# Altium project PCB_Project.PrjPcb
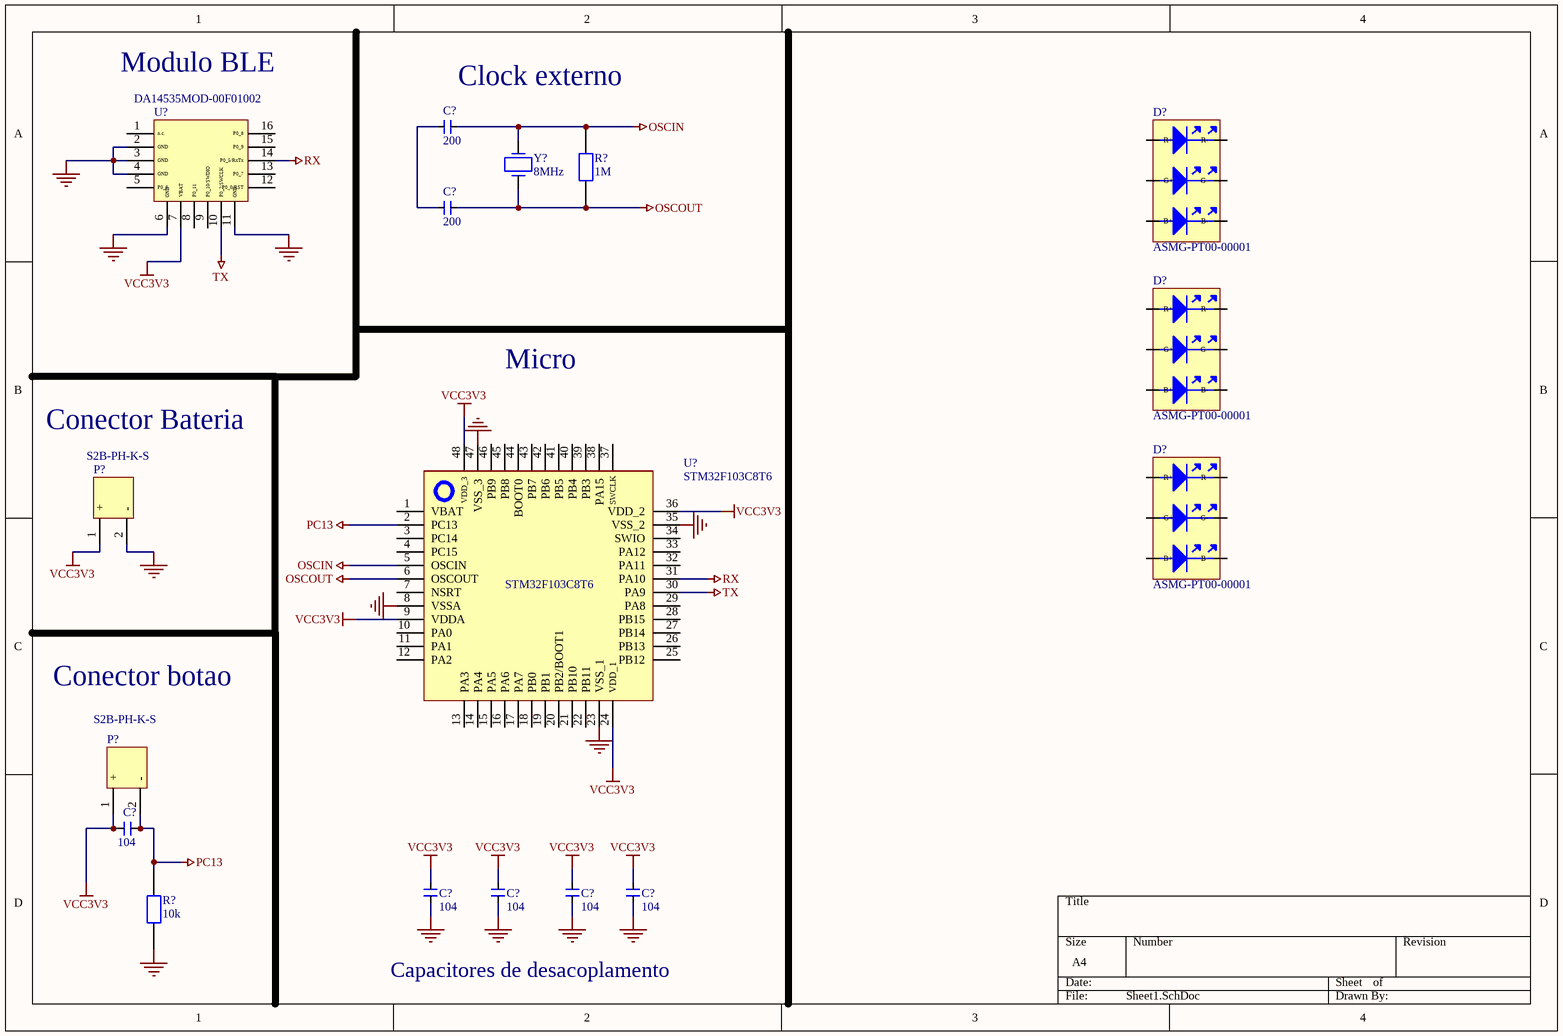
[diagram p0: Sheet1.SchDoc]
1 sheet, 17 parts. Net scope: global (net labels, ports and power ports of the same name join across sheets).
Board file: PCB1.PcbDoc

## Sheet Sheet1.SchDoc
size A4; SheetNumber: 1; SheetTotal: 1

### Parts
(Parts that share a designator on the sheet are numbered #1, #2 ... from top to bottom, then left to right.)
C?#1  200
C?#2  200
C?#3  104
C?#4  104
C?#5  104
C?#6  104
C?#7  104
D?#1  ASMG-PT00-00001
D?#2  ASMG-PT00-00001
D?#3  ASMG-PT00-00001
P?#1  S2B-PH-K-S
P?#2  S2B-PH-K-S
R?#1  1M
R?#2  10k
U?#1  DA14535MOD-00F01002
U?#2  STM32F103C8T6
Y?  8MHz

### Nets
GND: C?#4.2 C?#5.2 C?#6.2 C?#7.2 P?#1.2(-) R?#2.1 U?#1.2(GND) U?#1.3(GND) U?#1.4(GND) U?#1.6(GND) U?#1.11(GND) U?#2.8(VSSA) U?#2.23(VSS_1) U?#2.35(VSS_2) U?#2.47(VSS_3)
OSCIN: C?#1.2 R?#1.2 U?#2.5(OSCIN) Y?.1
OSCOUT: C?#2.2 R?#1.1 U?#2.6(OSCOUT) Y?.2
PC13: C?#3.2 P?#2.2(-) R?#2.2 U?#2.2(PC13)
RX: U?#1.14(P0_5/RxTx) U?#2.31(PA10)
TX: U?#1.10(P0_2/SWCLK) U?#2.30(PA9)
VCC3V3: C?#3.1 C?#4.1 C?#5.1 C?#6.1 C?#7.1 P?#1.1(+) P?#2.1(+) U?#1.7(VBAT) U?#2.9(VDDA) U?#2.24(VDD_1) U?#2.36(VDD_2) U?#2.48(VDD_3)
NetC?#1_1: C?#1.1 C?#2.1

Not connected (* = marked no-connect by the designer): D?#1 1(R+) 2(R-) 3(G+) 4(G-) 5(B+) 6(B-); D?#2 1(R+) 2(R-) 3(G+) 4(G-) 5(B+) 6(B-); D?#3 1(R+) 2(R-) 3(G+) 4(G-) 5(B+) 6(B-); U?#1 1(n.c.) 5(P0_6) 8(P0_11) 9(P0_10/SWDIO) 12(P0_0/RST) 13(P0_7) 15(P0_9) 16(P0_8); U?#2 1(VBAT) 3(PC14) 4(PC15) 7(NSRT) 10(PA0) 11(PA1) 12(PA2) 13(PA3) 14(PA4) 15(PA5) 16(PA6) 17(PA7) 18(PB0) 19(PB1) 20(PB2/BOOT1) 21(PB10) 22(PB11) 25(PB12) 26(PB13) 27(PB14) 28(PB15) 29(PA8) 32(PA11) 33(PA12) 34(SWIO) 37(SWCLK) 38(PA15) 39(PB3) 40(PB4) 41(PB5) 42(PB6) 43(PB7) 44(BOOT0) 45(PB8) 46(PB9)

### Notes on the sheet
- Modulo BLE
- (near C?#1) Clock externo
- Micro
- Conector Bateria
- Conector botao
- Capacitores de desacoplamento

### Library data of the parts
C?#1 C?#2 = CL10C200JB81PNC: Cap Ceramic 20pF 50V C0G 5% Pad SMD 0603 125C Automotive T/R; Manufacturer: Samsung Electro-Mechanics; Temperature Coefficient: 30ppm/°C; Supplier: DigiKey; Supplier Part Number: 1276-2219-1-ND; Manufacturer Part Number: CL10C200JB81PNC; RoHS: Compliant; Category: Ceramic Capacitors; Stock: 9751; Pricing: 1=0,12, 10=0,066, 50=0,043, 100=0,035, 500=0,0233, 1000=0,02004 (USD); Value: 20pF; Case/Package: 0603; Case Code (Imperial): 0603; Case Code (Metric): 1608; China RoHS: Compliant; Depth: 800µm; Dielectric: C0G; Dielectric Material: Ceramic; Height: 900µm; Length: 1.6002mm; Lifecycle Status: Production; Material: Ceramic; Max Operating Temperature: 125°C; Min Operating Temperature: -55°C; Mounting Technology: Surface Mount; Number of Terminals: 2; Packaging: Tape & Reel (TR); Ratings: AEC-Q200; REACH SVHC: Yes; Thickness: 889µm; Tolerance: 5%; Voltage Rating: 50V; Voltage Rating (DC): 50V; Width: 787.4µm; ComponentLink1URL: https://datasheet.octopart.com:443/CL10C200JB81PNC-Samsung-Electro-Mechanics-datasheet-176142735.pdf?src-supplier=IHS; ComponentLink1Description: https://datasheet.octopart.com:443/CL10C200JB81PNC-Samsung-Electro-Mechanics-datasheet-176142735.pdf?src-supplier=IHS; ComponentLink2URL: https://datasheet.octopart.com:443/CL10C200JB81PNC-Samsung-Electro-Mechanics-datasheet-141347356.pdf?src-supplier=Samsung+SCT; ComponentLink2Description: https://datasheet.octopart.com:443/CL10C200JB81PNC-Samsung-Electro-Mechanics-datasheet-141347356.pdf?src-supplier=Samsung+SCT; ComponentLink3URL: https://datasheet.octopart.com:443/CL10C200JB81PNC-Samsung-Electro-Mechanics-datasheet-11972684.pdf?src-supplier=Arrow+Electronics; ComponentLink3Description: https://datasheet.octopart.com:443/CL10C200JB81PNC-Samsung-Electro-Mechanics-datasheet-11972684.pdf?src-supplier=Arrow+Electronics
C?#3-C?#7 = CL03A104KP3NNNC: Ceramic Capacitor, Multilayer, Ceramic, 10V, 10% +Tol, 10% -Tol, X5R, +-15% TC, 100nF, Surface Mount, 0201 inch; Manufacturer: Samsung Electro-Mechanics; Supplier: DigiKey; Supplier Part Number: 1276-1115-1-ND; Manufacturer Part Number: CL03A104KP3NNNC; RoHS: Compliant; Category: Ceramic Capacitors; Stock: 3148810; Pricing: 1=0,08, 10=0,003 (USD); Value: 100nF; Case/Package: 0201; Case Code (Imperial): 0201; Case Code (Metric): 0603; China RoHS: Compliant; Contact Plating: Tin; Depth: 300µm; Dielectric: X5R; Dielectric Material: Ceramic; Height: 300µm; Lead Free: Lead Free; Length: 600µm; Lifecycle Status: Production; Material: Ceramic; Max Operating Temperature: 85°C; Min Operating Temperature: -55°C; Mounting Technology: Surface Mount; Number of Terminals: 2; Packaging: Tape & Reel; Radiation Hardening: No; REACH SVHC: Yes; Schedule B: 8532240020, 8532240020|8532240020, 8532240020|8532240020|8532240020, 8532240020|8532240020|8532240020|8532240020; Thickness: 330.2µm; Tolerance: 10%; Voltage Rating: 10V; Voltage Rating (DC): 10V; Width: 300µm; ComponentLink1URL: https://datasheet.octopart.com:443/CL03A104KP3NNNC-Samsung-Electro-Mechanics-datasheet-136031699.pdf?src-supplier=IHS; ComponentLink1Description: https://datasheet.octopart.com:443/CL03A104KP3NNNC-Samsung-Electro-Mechanics-datasheet-136031699.pdf?src-supplier=IHS; ComponentLink2URL: https://datasheet.octopart.com:443/CL03A104KP3NNNC-Samsung-Electro-Mechanics-datasheet-141346650.pdf?src-supplier=Samsung+SCT; ComponentLink2Description: https://datasheet.octopart.com:443/CL03A104KP3NNNC-Samsung-Electro-Mechanics-datasheet-141346650.pdf?src-supplier=Samsung+SCT; ComponentLink3URL: https://datasheet.octopart.com:443/CL03A104KP3NNNC-Samsung-Electro-Mechanics-datasheet-110226168.pdf?src-supplier=Future+Electronics; ComponentLink3Description: https://datasheet.octopart.com:443/CL03A104KP3NNNC-Samsung-Electro-Mechanics-datasheet-110226168.pdf?src-supplier=Future+Electronics; ComponentLink4URL: https://datasheet.octopart.com:443/CL03A104KP3NNNC-Samsung-Electro-Mechanics-datasheet-96443584.pdf?src-supplier=Future+Electronics; ComponentLink4Description: https://datasheet.octopart.com:443/CL03A104KP3NNNC-Samsung-Electro-Mechanics-datasheet-96443584.pdf?src-supplier=Future+Electronics; ComponentLink5URL: https://datasheet.octopart.com:443/CL03A104KP3NNNC-Samsung-Electro-Mechanics-datasheet-68297032.pdf?src-supplier=Future+Electronics; ComponentLink5Description: https://datasheet.octopart.com:443/CL03A104KP3NNNC-Samsung-Electro-Mechanics-datasheet-68297032.pdf?src-supplier=Future+Electronics; ComponentLink6URL: https://datasheet.octopart.com:443/CL03A104KP3NNNC-Samsung-datasheet-42485101.pdf?src-supplier=Future+Electronics; ComponentLink6Description: https://datasheet.octopart.com:443/CL03A104KP3NNNC-Samsung-datasheet-42485101.pdf?src-supplier=Future+Electronics; ComponentLink7URL: https://datasheet.octopart.com:443/CL03A104KP3NNNC-Samsung-datasheet-28508247.pdf?src-supplier=Future+Electronics; ComponentLink7Description: https://datasheet.octopart.com:443/CL03A104KP3NNNC-Samsung-datasheet-28508247.pdf?src-supplier=Future+Electronics; ComponentLink8URL: https://datasheet.octopart.com:443/CL03A104KP3NNNC-Samsung-datasheet-8325397.pdf?src-supplier=Future+Electronics; ComponentLink8Description: https://datasheet.octopart.com:443/CL03A104KP3NNNC-Samsung-datasheet-8325397.pdf?src-supplier=Future+Electronics; ComponentLink9URL: https://datasheet.octopart.com:443/CL03A104KP3NNNC-Samsung-Electro-Mechanics-datasheet-149136603.pdf?src-supplier=Future+Electronics; ComponentLink9Description: https://datasheet.octopart.com:443/CL03A104KP3NNNC-Samsung-Electro-Mechanics-datasheet-149136603.pdf?src-supplier=Future+Electronics; ComponentLink10URL: https://datasheet.octopart.com/CL03A104KP3NNNC-Samsung-Electro-Mechanics-datasheet-97040617.pdf; ComponentLink10Description: https://datasheet.octopart.com/CL03A104KP3NNNC-Samsung-Electro-Mechanics-datasheet-97040617.pdf; ComponentLink11URL: https://datasheet.octopart.com/CL03A104KP3NNNC-Samsung-Electro-Mechanics-datasheet-8324245.pdf; ComponentLink11Description: https://datasheet.octopart.com/CL03A104KP3NNNC-Samsung-Electro-Mechanics-datasheet-8324245.pdf; ComponentLink12URL: https://datasheet.octopart.com/General-Multilayer-Ceramic-Capacitors-Samsung-datasheet-family-111.pdf; ComponentLink12Description: https://datasheet.octopart.com/General-Multilayer-Ceramic-Capacitors-Samsung-datasheet-family-111.pdf; ComponentLink13URL: https://datasheet.octopart.com:443/CL03A104KP3NNNC-Samsung-datasheet-8326407.pdf?src-supplier=TME; ComponentLink13Description: https://datasheet.octopart.com:443/CL03A104KP3NNNC-Samsung-datasheet-8326407.pdf?src-supplier=TME; ComponentLink14URL: https://datasheet.octopart.com:443/CL03A104KP3NNNC-Samsung-Electro-Mechanics-datasheet-11541288.pdf?src-supplier=Arrow+Electronics; ComponentLink14Description: https://datasheet.octopart.com:443/CL03A104KP3NNNC-Samsung-Electro-Mechanics-datasheet-11541288.pdf?src-supplier=Arrow+Electronics; ComponentLink15URL: http://sigma.octopart.com:80/rohs_certificate/General-Multilayer-Ceramic-Capacitors-Samsung-family-110.pdf?src-supplier=Compliance+Statements; ComponentLink15Description: http://sigma.octopart.com:80/rohs_certificate/General-Multilayer-Ceramic-Capacitors-Samsung-family-110.pdf?src-supplier=Compliance+Statements; ComponentLink16URL: http://sigma.octopart.com:80/rohs_statement/General-Multilayer-Ceramic-Capacitors-Samsung-family-132.pdf?src-supplier=Compliance+Statements; ComponentLink16Description: http://sigma.octopart.com:80/rohs_statement/General-Multilayer-Ceramic-Capacitors-Samsung-family-132.pdf?src-supplier=Compliance+Statements; ComponentLink17URL: http://sigma.octopart.com:80/reach_statement/General-Multilayer-Ceramic-Capacitors-Samsung-family-133.pdf?src-supplier=Compliance+Statements; ComponentLink17Description: http://sigma.octopart.com:80/reach_statement/General-Multilayer-Ceramic-Capacitors-Samsung-family-133.pdf?src-supplier=Compliance+Statements
D?#1-D?#3 = ASMG-PT00-00001: 1W High Power LED Red/Green/Orange 630nm/535nm/460nm 28lm/45lm/9.5lm 6-Pin SMD T/R; Manufacturer: Avago; Forward Current: 200mA; Forward Voltage: 2.8V; Number of Circuits: 1; Shape: Round; Viewing Angle: 150°; Supplier: DigiKey; Supplier Part Number: 516-4178-1-ND; Manufacturer Part Number: ASMG-PT00-00001; RoHS: Compliant; Category: LEDs; Stock: 2617; Pricing: 1=7,73, 10=5,867, 100=4,7744 (USD); Height: 1.85mm; Lifecycle Status: Production; Max Operating Temperature: 105°C; Min Operating Temperature: -40°C; Mounting Technology: Surface Mount; Number of Terminals: 6; REACH SVHC: Yes; Terminal Pitch: 1.32mm; ComponentLink1URL: https://datasheet.octopart.com:443/ASMG-PT00-00001-Broadcom-datasheet-179992978.pdf?src-supplier=IHS; ComponentLink1Description: https://datasheet.octopart.com:443/ASMG-PT00-00001-Broadcom-datasheet-179992978.pdf?src-supplier=IHS; ComponentLink2URL: https://datasheet.octopart.com:443/ASMG-PT00-00001-Avago-datasheet-104530126.pdf?src-supplier=Avago; ComponentLink2Description: https://datasheet.octopart.com:443/ASMG-PT00-00001-Avago-datasheet-104530126.pdf?src-supplier=Avago; ComponentLink3URL: https://datasheet.octopart.com:443/ASMG-PT00-00001-Broadcom-datasheet-141402584.pdf?src-supplier=element14+APAC; ComponentLink3Description: https://datasheet.octopart.com:443/ASMG-PT00-00001-Broadcom-datasheet-141402584.pdf?src-supplier=element14+APAC; ComponentLink4URL: https://datasheet.octopart.com:443/ASMG-PT00-00001-Broadcom-datasheet-104526721.pdf?src-supplier=Newark; ComponentLink4Description: https://datasheet.octopart.com:443/ASMG-PT00-00001-Broadcom-datasheet-104526721.pdf?src-supplier=Newark
P?#1 P?#2 = S2B-PH-K-S: Header S2B-PH-K-S, 2.00mm, 2-contacts, side entry, THT /1000/box/; Manufacturer: JST; Connector Type: Male Pin; Gender: Male; Number of Contacts: 2; Pitch: 2.0066mm; Supplier: DigiKey; Supplier Part Number: 455-1719-ND; Manufacturer Part Number: S2B-PH-K-S; RoHS: Compliant; Category: Headers and Wire Housings; Stock: 969719; Pricing: 1=0,1, 10=0,082, 100=0,0698, 500=0,06228, 1000=0,05929, 5000=0,05292, 10000=0,05039 (USD); Contact Gender: Male; Contact Material: Brass; Contact Mating Length: 3.302mm; Contact Plating: Tin; Fastening Type: Detent; Housing Color: Natural; Housing Material: Nylon; Lead Free: Contains Lead; Lead Pitch: 2mm; Lifecycle Status: Obsolete; Mounting Technology: Through Hole; Pins: 2; Number of Positions: 2; Number of Rows: 1; Orientation: Horizontal; Packaging: Bulk; Terminal Pitch: 2mm; Termination: Press-Fit; ComponentLink1URL: https://datasheet.octopart.com:443/S2B-PH-K-S-JST-datasheet-15068535.pdf?src-supplier=IHS; ComponentLink1Description: https://datasheet.octopart.com:443/S2B-PH-K-S-JST-datasheet-15068535.pdf?src-supplier=IHS; ComponentLink2URL: https://datasheet.octopart.com:443/S2B-PH-K-S-JST-datasheet-12510261.pdf?src-supplier=TME; ComponentLink2Description: https://datasheet.octopart.com:443/S2B-PH-K-S-JST-datasheet-12510261.pdf?src-supplier=TME; ComponentLink3URL: https://datasheet.octopart.com:443/S2B-PH-K-S-JST-datasheet-56537.pdf?src-supplier=DigiKey; ComponentLink3Description: https://datasheet.octopart.com:443/S2B-PH-K-S-JST-datasheet-56537.pdf?src-supplier=DigiKey; ComponentLink4URL: https://datasheet.octopart.com:443/S2B-PH-K-S-JST-datasheet-159515011.pdf?src-supplier=Amar+Radio+Corporation; ComponentLink4Description: https://datasheet.octopart.com:443/S2B-PH-K-S-JST-datasheet-159515011.pdf?src-supplier=Amar+Radio+Corporation
R?#1 = ERJ-PA3F1004V: Res Thick Film 0603 1M Ohm 1% 0.25W(1/4W) ±100ppm/C Pad SMD Automotive T/R; Manufacturer: Panasonic; Max Power Dissipation: 250mW; Value: 1MΩ; Temperature Coefficient: 100ppm/°C; Voltage Rating: 150V; Supplier: DigiKey; Supplier Part Number: P1.0MBYCT-ND; Manufacturer Part Number: ERJ-PA3F1004V; RoHS: Compliant; Category: Chip SMD Resistors; Stock: 243307; Pricing: 1=0,14, 10=0,068, 25=0,0532, 50=0,0446, 100=0,0377, 250=0,03096, 500=0,0271, 1000=0,02402 (USD); Case/Package: 0603; Case Code (Imperial): 0603; Case Code (Metric): 1608; Composition: Thick Film; Depth: 800µm; Features: Automotive AEC-Q200; Height: 450µm; Length: 1.6002mm; Lifecycle Status: Production; Max Operating Temperature: 155°C; Min Operating Temperature: -55°C; Mounting Technology: Surface Mount; Number of Terminals: 2; Number of Terminations: 2; Packaging: Cut Tape; Power Dissipation: 250mW; Power Rating: 250mW; REACH SVHC: Yes; Schedule B: 8533210045, 8533210045|8533210045|8533210045|8533210045|8533210045|8533210045|8533210045|8533210045|8533210045|8533210045|8533210045|8533210045|8533210045|8533210045|8533210045|8533210045|8533210045|8533210045|8533210045|8533210045|8533210045|8533210045|8533210045|85; Termination: Solder; Tolerance: 1%; Voltage Rating (DC): 150V; Width: 800µm; Working Voltage: 150V; ComponentLink1URL: https://datasheet.octopart.com:443/ERJ-PA3F1004V-Panasonic-datasheet-68299097.pdf?src-supplier=Future+Electronics; ComponentLink1Description: https://datasheet.octopart.com:443/ERJ-PA3F1004V-Panasonic-datasheet-68299097.pdf?src-supplier=Future+Electronics; ComponentLink2URL: https://datasheet.octopart.com:443/ERJ-PA3F1004V-Panasonic-datasheet-136608609.pdf?src-supplier=Farnell; ComponentLink2Description: https://datasheet.octopart.com:443/ERJ-PA3F1004V-Panasonic-datasheet-136608609.pdf?src-supplier=Farnell; ComponentLink3URL: https://datasheet.octopart.com:443/ERJPA3F1004V-Panasonic-datasheet-21212021.pdf?src-supplier=Farnell; ComponentLink3Description: https://datasheet.octopart.com:443/ERJPA3F1004V-Panasonic-datasheet-21212021.pdf?src-supplier=Farnell; ComponentLink4URL: https://datasheet.octopart.com:443/ERJPA3F1004V-Panasonic-datasheet-16484091.pdf?src-supplier=Farnell; ComponentLink4Description: https://datasheet.octopart.com:443/ERJPA3F1004V-Panasonic-datasheet-16484091.pdf?src-supplier=Farnell; ComponentLink5URL: https://datasheet.octopart.com:443/ERJPA3F1004V-Panasonic-datasheet-5389633.pdf?src-supplier=RS+(Formerly+Allied+Electronics); ComponentLink5Description: https://datasheet.octopart.com:443/ERJPA3F1004V-Panasonic-datasheet-5389633.pdf?src-supplier=RS+(Formerly+Allied+Electronics); ComponentLink6URL: https://datasheet.octopart.com:443/ERJ-PA3F1004V-Panasonic-datasheet-142522929.pdf?src-supplier=Master+Electronics; ComponentLink6Description: https://datasheet.octopart.com:443/ERJ-PA3F1004V-Panasonic-datasheet-142522929.pdf?src-supplier=Master+Electronics; ComponentLink7URL: https://datasheet.octopart.com:443/ERJPA3F1004V-Panasonic-datasheet-10838877.pdf?src-supplier=element14+APAC; ComponentLink7Description: https://datasheet.octopart.com:443/ERJPA3F1004V-Panasonic-datasheet-10838877.pdf?src-supplier=element14+APAC; ComponentLink8URL: https://datasheet.octopart.com:443/ERJPA3F1004V-Panasonic-datasheet-10403718.pdf?src-supplier=element14+APAC; ComponentLink8Description: https://datasheet.octopart.com:443/ERJPA3F1004V-Panasonic-datasheet-10403718.pdf?src-supplier=element14+APAC; ComponentLink9URL: https://datasheet.octopart.com:443/ERJPA3F1004V-Panasonic-datasheet-10096723.pdf?src-supplier=element14+APAC; ComponentLink9Description: https://datasheet.octopart.com:443/ERJPA3F1004V-Panasonic-datasheet-10096723.pdf?src-supplier=element14+APAC; ComponentLink10URL: https://datasheet.octopart.com:443/ERJPA3F1004V-Panasonic-datasheet-8399050.pdf?src-supplier=element14+APAC; ComponentLink10Description: https://datasheet.octopart.com:443/ERJPA3F1004V-Panasonic-datasheet-8399050.pdf?src-supplier=element14+APAC; ComponentLink11URL: https://datasheet.octopart.com:443/ERJPA3F1004V-Panasonic-datasheet-13272697.pdf?src-supplier=element14+APAC; ComponentLink11Description: https://datasheet.octopart.com:443/ERJPA3F1004V-Panasonic-datasheet-13272697.pdf?src-supplier=element14+APAC; ComponentLink12URL: https://datasheet.octopart.com:443/ERJPA3F1004V-Panasonic-datasheet-60482970.pdf?src-supplier=element14+APAC; ComponentLink12Description: https://datasheet.octopart.com:443/ERJPA3F1004V-Panasonic-datasheet-60482970.pdf?src-supplier=element14+APAC; ComponentLink13URL: https://datasheet.octopart.com:443/ERJPA3F1004V-Panasonic-datasheet-170667599.pdf?src-supplier=TME; ComponentLink13Description: https://datasheet.octopart.com:443/ERJPA3F1004V-Panasonic-datasheet-170667599.pdf?src-supplier=TME; ComponentLink14URL: https://datasheet.octopart.com:443/ERJPA3F1004V-Panasonic-datasheet-164871483.pdf?src-supplier=Burklin+Elektronik; ComponentLink14Description: https://datasheet.octopart.com:443/ERJPA3F1004V-Panasonic-datasheet-164871483.pdf?src-supplier=Burklin+Elektronik; ComponentLink15URL: https://datasheet.octopart.com:443/ERJ-PA3F1004V-Panasonic-datasheet-62334979.pdf?src-supplier=Newark; ComponentLink15Description: https://datasheet.octopart.com:443/ERJ-PA3F1004V-Panasonic-datasheet-62334979.pdf?src-supplier=Newark
R?#2 = ERA-3AEB103V: Res Thin Film 0603 10K Ohm 0.1% 1/10W ±25ppm/°C Molded SMD SMD Punched Carrier T/R; Manufacturer: Panasonic; Max Power Dissipation: 100mW; Value: 10kΩ; Voltage Rating: 75V; Supplier: DigiKey; Supplier Part Number: P10KDBCT-ND; Manufacturer Part Number: ERA-3AEB103V; RoHS: Compliant; Category: Chip SMD Resistors; Stock: 1068541; Pricing: 1=0,1, 10=0,061, 25=0,0568, 50=0,0536, 100=0,0506, 250=0,04692, 500=0,04438, 1000=0,04206 (USD); Case/Package: 0603; Case Code (Imperial): 0603; Composition: Thin Film; Contact Plating: Tin; Depth: 800µm; Height: 450µm; Lead Free: Lead Free; Length: 1.6mm; Lifecycle Status: Production; Max Operating Temperature: 155°C; Military Standard: Not; Min Operating Temperature: -55°C; Mounting Technology: Surface Mount; Pins: 2; Number of Terminals: 2; Number of Terminations: 2; Packaging: Cut Tape; Power Dissipation: 100mW; Power Rating: 100mW; Radiation Hardening: No; REACH SVHC: Yes; Schedule B: 8533210045, 8533210045|8533210045|8533210045|8533210045|8533210045|8533210045|8533210045|8533210045|8533210045|8533210045|8533210045|8533210045|8533210045|8533210045|8533210045|8533210045|8533210045|8533210045|8533210045|8533210045|8533210045|8533210045|8533210045|85; Temperature Coefficient: 25ppm/°C; Termination: SMD/SMT; Tolerance: 0.1%; Voltage Rating (DC): 75V; Width: 800µm; Working Voltage: 75V; ComponentLink1URL: https://sigma.octopart.com:443/138766958/technical_drawing/Panasonic-ERA-3AEB103V.pdf?src-supplier=Upverter; ComponentLink1Description: https://sigma.octopart.com:443/138766958/technical_drawing/Panasonic-ERA-3AEB103V.pdf?src-supplier=Upverter; ComponentLink2URL: https://datasheet.octopart.com:443/ERA-3AEB103V-Panasonic-datasheet-62287448.pdf?src-supplier=Newark; ComponentLink2Description: https://datasheet.octopart.com:443/ERA-3AEB103V-Panasonic-datasheet-62287448.pdf?src-supplier=Newark; ComponentLink3URL: https://datasheet.octopart.com:443/ERA-3AEB103V-Panasonic-datasheet-118567.pdf?src-supplier=Newark; ComponentLink3Description: https://datasheet.octopart.com:443/ERA-3AEB103V-Panasonic-datasheet-118567.pdf?src-supplier=Newark; ComponentLink4URL: https://datasheet.octopart.com:443/ERA-3AEB103V-Panasonic-datasheet-61114971.pdf?src-supplier=Newark; ComponentLink4Description: https://datasheet.octopart.com:443/ERA-3AEB103V-Panasonic-datasheet-61114971.pdf?src-supplier=Newark; ComponentLink5URL: https://datasheet.octopart.com:443/ERA3AEB103V-Panasonic-datasheet-22087624.pdf?src-supplier=Newark; ComponentLink5Description: https://datasheet.octopart.com:443/ERA3AEB103V-Panasonic-datasheet-22087624.pdf?src-supplier=Newark; ComponentLink6URL: https://datasheet.octopart.com:443/ERA-3AEB103V-Panasonic-datasheet-136531316.pdf?src-supplier=Farnell; ComponentLink6Description: https://datasheet.octopart.com:443/ERA-3AEB103V-Panasonic-datasheet-136531316.pdf?src-supplier=Farnell; ComponentLink7URL: https://datasheet.octopart.com:443/ERA-3AEB103V-Panasonic-datasheet-13266200.pdf?src-supplier=RS+(Formerly+Allied+Electronics); ComponentLink7Description: https://datasheet.octopart.com:443/ERA-3AEB103V-Panasonic-datasheet-13266200.pdf?src-supplier=RS+(Formerly+Allied+Electronics); ComponentLink8URL: https://datasheet.octopart.com:443/ERA-3AEB103V-Panasonic-datasheet-46744048.pdf?src-supplier=RS+(Formerly+Allied+Electronics); ComponentLink8Description: https://datasheet.octopart.com:443/ERA-3AEB103V-Panasonic-datasheet-46744048.pdf?src-supplier=RS+(Formerly+Allied+Electronics); ComponentLink9URL: https://datasheet.octopart.com:443/ERA-3AEB103V-Panasonic-datasheet-10840895.pdf?src-supplier=Future+Electronics; ComponentLink9Description: https://datasheet.octopart.com:443/ERA-3AEB103V-Panasonic-datasheet-10840895.pdf?src-supplier=Future+Electronics; ComponentLink10URL: https://datasheet.octopart.com:443/ERA-3AEB103V-Panasonic-datasheet-8367715.pdf?src-supplier=Future+Electronics; ComponentLink10Description: https://datasheet.octopart.com:443/ERA-3AEB103V-Panasonic-datasheet-8367715.pdf?src-supplier=Future+Electronics; ComponentLink11URL: https://datasheet.octopart.com:443/ERA-3AEB103V-Panasonic-datasheet-12510007.pdf?src-supplier=Future+Electronics; ComponentLink11Description: https://datasheet.octopart.com:443/ERA-3AEB103V-Panasonic-datasheet-12510007.pdf?src-supplier=Future+Electronics; ComponentLink12URL: https://datasheet.octopart.com:443/ERA-3AEB103V-Panasonic-datasheet-11763931.pdf?src-supplier=Future+Electronics; ComponentLink12Description: https://datasheet.octopart.com:443/ERA-3AEB103V-Panasonic-datasheet-11763931.pdf?src-supplier=Future+Electronics; ComponentLink13URL: https://datasheet.octopart.com:443/ERA-3AEB103V-Panasonic-datasheet-5392808.pdf?src-supplier=Future+Electronics; ComponentLink13Description: https://datasheet.octopart.com:443/ERA-3AEB103V-Panasonic-datasheet-5392808.pdf?src-supplier=Future+Electronics; ComponentLink14URL: https://datasheet.octopart.com:443/ERA-3AEB103V-Panasonic-datasheet-154766165.pdf?src-supplier=Master+Electronics; ComponentLink14Description: https://datasheet.octopart.com:443/ERA-3AEB103V-Panasonic-datasheet-154766165.pdf?src-supplier=Master+Electronics; ComponentLink15URL: https://datasheet.octopart.com:443/ERA3AEB103V-Panasonic-datasheet-188913046.pdf?src-supplier=TME; ComponentLink15Description: https://datasheet.octopart.com:443/ERA3AEB103V-Panasonic-datasheet-188913046.pdf?src-supplier=TME; ComponentLink16URL: https://sigma.octopart.com:443/150570796/technical_drawing/Panasonic-ERA3AEB103V.pdf?src-supplier=Panasonic+SCT; ComponentLink16Description: https://sigma.octopart.com:443/150570796/technical_drawing/Panasonic-ERA3AEB103V.pdf?src-supplier=Panasonic+SCT; ComponentLink17URL: https://datasheet.octopart.com:443/ERA3AEB103V-Panasonic-datasheet-138783076.pdf?src-supplier=Burklin+Elektronik; ComponentLink17Description: https://datasheet.octopart.com:443/ERA3AEB103V-Panasonic-datasheet-138783076.pdf?src-supplier=Burklin+Elektronik; ComponentLink18URL: https://datasheet.octopart.com/ERA-3AEB103V-Panasonic-datasheet-78375410.pdf; ComponentLink18Description: https://datasheet.octopart.com/ERA-3AEB103V-Panasonic-datasheet-78375410.pdf; ComponentLink19URL: https://datasheet.octopart.com:443/ERA-3AEB103V-Panasonic-datasheet-10050158.pdf?src-supplier=Arrow+Electronics; ComponentLink19Description: https://datasheet.octopart.com:443/ERA-3AEB103V-Panasonic-datasheet-10050158.pdf?src-supplier=Arrow+Electronics; ComponentLink20URL: https://datasheet.octopart.com:443/ERA-3AEB103V-Panasonic-datasheet-33006989.pdf?src-supplier=Electro+Sonic; ComponentLink20Description: https://datasheet.octopart.com:443/ERA-3AEB103V-Panasonic-datasheet-33006989.pdf?src-supplier=Electro+Sonic
U?#1 = DA14535MOD-00F01002: Bluetooth Mod, Ble 5.3, 1.8 - 3.6V Rohs Compliant: Yes |Renesas DA14535MOD-00F01002; Manufacturer Lifecycle Status: ACTIVE; Pitch: 1.5mm; Supplier: DigiKey; Supplier Part Number: 1695-DA14535MOD-00F01002CT-ND; Manufacturer: Renesas; Manufacturer Part Number: DA14535MOD-00F01002; Category: RF Transceiver Modules and Modems; Stock: 692; Pricing: 1=6,97, 10=6,039, 25=5,7156, 100=5,2718, 250=5,00596, 500=4,8183 (USD); Case/Package: Module; Export Control Classification Number (ECCN) Code: EAR99; Part Family: DA14535MOD; Harmonized Tariff Schedule (HTS) Code: 8542.39.90; Lifecycle Status: Production; MSL: 3; Pins: 15; Packaging: Tape & Reel; ComponentLink1URL: https://datasheet.octopart.com:443/DA14535MOD-00F01002-Renesas-datasheet-182587836.pdf?src-supplier=Renesas; ComponentLink1Description: https://datasheet.octopart.com:443/DA14535MOD-00F01002-Renesas-datasheet-182587836.pdf?src-supplier=Renesas; ComponentLink2URL: http://sigma.octopart.com:80/conflict_mineral_statement/Renesas-company-44.pdf?src-supplier=Compliance+Statements; ComponentLink2Description: http://sigma.octopart.com:80/conflict_mineral_statement/Renesas-company-44.pdf?src-supplier=Compliance+Statements; ComponentLink3URL: http://sigma.octopart.com:80/reach_statement/Renesas-company-45.pdf?src-supplier=Compliance+Statements; ComponentLink3Description: http://sigma.octopart.com:80/reach_statement/Renesas-company-45.pdf?src-supplier=Compliance+Statements
U?#2 = STM32F103C8T6: MCU 32-bit STM32F1 ARM Cortex M3 RISC 64KB Flash 2.5V/3.3V 48-Pin LQFP Tray; Manufacturer: STMicroelectronics; Manufacturer Package Identifier: ai14911d; ADC Channels (Resolution): 10-Ch 12-Bit; Address Bus Width: 32b; Density: 512kb; EEPROM Memory Size: 0B; Frequency: 72MHz; Interface: CAN, USB; Clock Frequency: 16MHz; Max Power Dissipation: 363mW; Max Supply Current: 50mA; Max Supply Voltage: 3.6V; Min Supply Voltage: 2V; Nominal Supply Current: 1.7µA; Number of A/D Converters: 2; Number of ADC Channels: 10; Number of Bits: 32; Number of I/Os: 37; Number of Interrupts: 16; Number of Programmable I/O: 48; Number of PWM Channels: 1; Number of Timers/Counters: 4; Number of USART Channels: 3; Operating Supply Voltage: 3.3V; Oscillator Type: Internal; Peripherals: POR; RAM Size: 20kB; Watchdog Timer: Yes; Supplier: DigiKey; Supplier Part Number: 497-6063-ND; Manufacturer Part Number: STM32F103C8T6; RoHS: Compliant; Category: Microcontrollers; Stock: 4493; Pricing: 1=6,08, 10=4,662, 25=4,3084, 100=3,9192, 250=3,73372, 500=3,6219, 1000=3,5299, 2500=3,43276 (USD); Case/Package: LQFP; China RoHS: Compliant; Core Architecture: ARM; Data Bus Width: 32b; Flash Memory Size: 64kB; Height: 1.45mm; Height - Seated (Max): 1.6mm; Lead Free: Lead Free; Length: 7mm; Lifecycle Status: Production; Max Operating Temperature: 85°C; Memory Size: 64kB; Memory Format: FLASH; Min Operating Temperature: -40°C; Mounting Technology: Surface Mount; Number of Channels: 10; Number of I2C Channels: 2; Pins: 48; Number of SPI Channels: 2; Number of Terminals: 48; Radiation Hardening: No; REACH SVHC: Yes; Schedule B: 8542310000; Terminal Pitch: 500µm; Termination: SMD/SMT; Width: 7mm; ComponentLink1URL: https://datasheet.octopart.com:443/STM32F103C8T6-STMicroelectronics-datasheet-48026265.pdf?src-supplier=ICpick; ComponentLink1Description: https://datasheet.octopart.com:443/STM32F103C8T6-STMicroelectronics-datasheet-48026265.pdf?src-supplier=ICpick; ComponentLink2URL: https://datasheet.octopart.com:443/STM32F103C8T6-STMicroelectronics-datasheet-10330614.pdf?src-supplier=Newark; ComponentLink2Description: https://datasheet.octopart.com:443/STM32F103C8T6-STMicroelectronics-datasheet-10330614.pdf?src-supplier=Newark; ComponentLink3URL: https://datasheet.octopart.com:443/STM32F103C8T6-STMicroelectronics-datasheet-16839800.pdf?src-supplier=Newark; ComponentLink3Description: https://datasheet.octopart.com:443/STM32F103C8T6-STMicroelectronics-datasheet-16839800.pdf?src-supplier=Newark; ComponentLink4URL: https://datasheet.octopart.com:443/STM32F103C8T6-STMicroelectronics-datasheet-14363502.pdf?src-supplier=Farnell; ComponentLink4Description: https://datasheet.octopart.com:443/STM32F103C8T6-STMicroelectronics-datasheet-14363502.pdf?src-supplier=Farnell; ComponentLink5URL: https://datasheet.octopart.com:443/STM32F103C8T6-STMicroelectronics-datasheet-500013.pdf?src-supplier=Farnell; ComponentLink5Description: https://datasheet.octopart.com:443/STM32F103C8T6-STMicroelectronics-datasheet-500013.pdf?src-supplier=Farnell; ComponentLink6URL: https://datasheet.octopart.com:443/STM32F103C8T6-STMicroelectronics-datasheet-8365036.pdf?src-supplier=Farnell; ComponentLink6Description: https://datasheet.octopart.com:443/STM32F103C8T6-STMicroelectronics-datasheet-8365036.pdf?src-supplier=Farnell; ComponentLink7URL: https://datasheet.octopart.com:443/STM32F103C8T6-STMicroelectronics-datasheet-6396519.pdf?src-supplier=Verical; ComponentLink7Description: https://datasheet.octopart.com:443/STM32F103C8T6-STMicroelectronics-datasheet-6396519.pdf?src-supplier=Verical; ComponentLink8URL: https://datasheet.octopart.com:443/STM32F103C8T6-STMicroelectronics-datasheet-21407612.pdf?src-supplier=element14+APAC; ComponentLink8Description: https://datasheet.octopart.com:443/STM32F103C8T6-STMicroelectronics-datasheet-21407612.pdf?src-supplier=element14+APAC; ComponentLink9URL: https://datasheet.octopart.com:443/STM32F103C8T6-STMicroelectronics-datasheet-8700640.pdf?src-supplier=element14; ComponentLink9Description: https://datasheet.octopart.com:443/STM32F103C8T6-STMicroelectronics-datasheet-8700640.pdf?src-supplier=element14; ComponentLink10URL: https://datasheet.octopart.com:443/STM32F103C8T6-STMicroelectronics-datasheet-177520228.pdf?src-supplier=Burklin+Elektronik; ComponentLink10Description: https://datasheet.octopart.com:443/STM32F103C8T6-STMicroelectronics-datasheet-177520228.pdf?src-supplier=Burklin+Elektronik; ComponentLink11URL: https://datasheet.octopart.com:443/STM32F103C8T6-STMicroelectronics-datasheet-165583531.pdf?src-supplier=SOS+electronic; ComponentLink11Description: https://datasheet.octopart.com:443/STM32F103C8T6-STMicroelectronics-datasheet-165583531.pdf?src-supplier=SOS+electronic; ComponentLink12URL: https://datasheet.octopart.com:443/STM32F103C8T6-STMicroelectronics-datasheet-14106722.pdf?src-supplier=iiiC; ComponentLink12Description: https://datasheet.octopart.com:443/STM32F103C8T6-STMicroelectronics-datasheet-14106722.pdf?src-supplier=iiiC; ComponentLink13URL: https://datasheet.octopart.com:443/STM32F103C8T6-STMicroelectronics-datasheet-17594274.pdf?src-supplier=TME; ComponentLink13Description: https://datasheet.octopart.com:443/STM32F103C8T6-STMicroelectronics-datasheet-17594274.pdf?src-supplier=TME; ComponentLink14URL: https://datasheet.octopart.com:443/STM32F103C8T6-STMicroelectronics-datasheet-148251.pdf?src-supplier=Nu+Horizons; ComponentLink14Description: https://datasheet.octopart.com:443/STM32F103C8T6-STMicroelectronics-datasheet-148251.pdf?src-supplier=Nu+Horizons
Y? = ABM3-8.000MHZ-D2Y-T: Crystal 8MHz ±20ppm (Tol) ±30ppm (Stability) 18pF FUND 140Ohm 2-Pin Mini-CSMD T/R; Manufacturer: Abracon; ESR (Equivalent Series Resistance): 140Ω; Frequency Tolerance: 0.002%; Supplier: DigiKey; Supplier Part Number: 535-10630-1-ND; Manufacturer Part Number: ABM3-8.000MHZ-D2Y-T; RoHS: Compliant; Category: Crystals; Stock: 32401; Pricing: 1=0,67, 10=0,585, 25=0,5536, 50=0,5306, 100=0,5087, 250=0,48104, 500=0,46114 (USD); Case/Package: CSMD; China RoHS: Non-Compliant; Composition: Ceramic; Depth: 3.2mm; Frequency: 8MHz; Frequency Stability: 30ppm; Height: 1.3mm; Lead Free: Lead Free; Length: 5mm; Lifecycle Status: Production; Load Capacitance: 18pF; Max Operating Temperature: 85°C; Min Operating Temperature: -40°C; Mounting Technology: Surface Mount; Pins: 2; Packaging: Cut Tape; Radiation Hardening: No; REACH SVHC: Yes; Schedule B: 8541600025, 8541600025|8541600025|8541600025|8541600025|8541600025|8541600025|8541600025|8541600025|8541600025|8541600025|8541600025|8541600025|8541600025|8541600025|8541600025|8541600025|8541600025|8541600025|8541600025|8541600025|8541600025|8541600025|8541600025|85; ESR: 140Ω; Termination: SMD/SMT; Tolerance: 0.002%; Width: 3.2mm; ComponentLink1URL: https://datasheet.octopart.com:443/ABM3-8.000MHZ-D2Y-T-Abracon-datasheet-182205007.pdf?src-supplier=TME; ComponentLink1Description: https://datasheet.octopart.com:443/ABM3-8.000MHZ-D2Y-T-Abracon-datasheet-182205007.pdf?src-supplier=TME; ComponentLink2URL: https://datasheet.octopart.com:443/ABM3-8.000MHZ-D2Y-T-Abracon-datasheet-32780515.pdf?src-supplier=element14+APAC; ComponentLink2Description: https://datasheet.octopart.com:443/ABM3-8.000MHZ-D2Y-T-Abracon-datasheet-32780515.pdf?src-supplier=element14+APAC; ComponentLink3URL: https://datasheet.octopart.com:443/ABM3-8.000MHZ-D2Y-T-Abracon-datasheet-13417521.pdf?src-supplier=element14+APAC; ComponentLink3Description: https://datasheet.octopart.com:443/ABM3-8.000MHZ-D2Y-T-Abracon-datasheet-13417521.pdf?src-supplier=element14+APAC; ComponentLink4URL: https://datasheet.octopart.com:443/ABM3-8.000MHZ-D2Y-T-Abracon-datasheet-8862594.pdf?src-supplier=element14+APAC; ComponentLink4Description: https://datasheet.octopart.com:443/ABM3-8.000MHZ-D2Y-T-Abracon-datasheet-8862594.pdf?src-supplier=element14+APAC; ComponentLink5URL: https://datasheet.octopart.com:443/ABM3-8.000MHZ-D2Y-T-Abracon-datasheet-8853172.pdf?src-supplier=element14+APAC; ComponentLink5Description: https://datasheet.octopart.com:443/ABM3-8.000MHZ-D2Y-T-Abracon-datasheet-8853172.pdf?src-supplier=element14+APAC; ComponentLink6URL: https://datasheet.octopart.com:443/ABM3-8.000MHZ-D2Y-T-Abracon-datasheet-8835795.pdf?src-supplier=element14+APAC; ComponentLink6Description: https://datasheet.octopart.com:443/ABM3-8.000MHZ-D2Y-T-Abracon-datasheet-8835795.pdf?src-supplier=element14+APAC; ComponentLink7URL: https://datasheet.octopart.com:443/ABM3-8.000MHZ-D2Y-T-Abracon-datasheet-8815637.pdf?src-supplier=element14+APAC; ComponentLink7Description: https://datasheet.octopart.com:443/ABM3-8.000MHZ-D2Y-T-Abracon-datasheet-8815637.pdf?src-supplier=element14+APAC; ComponentLink8URL: https://datasheet.octopart.com:443/ABM3-8.000MHZ-D2Y-T-Abracon-datasheet-8808528.pdf?src-supplier=element14+APAC; ComponentLink8Description: https://datasheet.octopart.com:443/ABM3-8.000MHZ-D2Y-T-Abracon-datasheet-8808528.pdf?src-supplier=element14+APAC; ComponentLink9URL: https://datasheet.octopart.com:443/ABM3-8.000MHZ-D2Y-T-Abracon-datasheet-8488864.pdf?src-supplier=element14+APAC; ComponentLink9Description: https://datasheet.octopart.com:443/ABM3-8.000MHZ-D2Y-T-Abracon-datasheet-8488864.pdf?src-supplier=element14+APAC; ComponentLink10URL: https://datasheet.octopart.com:443/ABM3-8.000MHZ-D2Y-T-Abracon-datasheet-8324950.pdf?src-supplier=element14+APAC; ComponentLink10Description: https://datasheet.octopart.com:443/ABM3-8.000MHZ-D2Y-T-Abracon-datasheet-8324950.pdf?src-supplier=element14+APAC; ComponentLink11URL: https://datasheet.octopart.com:443/ABM3-8.000MHZ-D2Y-T-Abracon-datasheet-577709.pdf?src-supplier=element14+APAC; ComponentLink11Description: https://datasheet.octopart.com:443/ABM3-8.000MHZ-D2Y-T-Abracon-datasheet-577709.pdf?src-supplier=element14+APAC; ComponentLink12URL: https://datasheet.octopart.com:443/ABM3-8.000MHZ-D2Y-T-Abracon-datasheet-154724144.pdf?src-supplier=Sager+Electronics; ComponentLink12Description: https://datasheet.octopart.com:443/ABM3-8.000MHZ-D2Y-T-Abracon-datasheet-154724144.pdf?src-supplier=Sager+Electronics; ComponentLink13URL: https://datasheet.octopart.com:443/ABM3-8.000MHZ-D2Y-T-Abracon-datasheet-128558659.pdf?src-supplier=X-ON; ComponentLink13Description: https://datasheet.octopart.com:443/ABM3-8.000MHZ-D2Y-T-Abracon-datasheet-128558659.pdf?src-supplier=X-ON; ComponentLink14URL: https://sigma.octopart.com:443/138895675/technical_drawing/Abracon-ABM3-8.000MHZ-D2Y-T.pdf?src-supplier=Abracon+SCT; ComponentLink14Description: https://sigma.octopart.com:443/138895675/technical_drawing/Abracon-ABM3-8.000MHZ-D2Y-T.pdf?src-supplier=Abracon+SCT; ComponentLink15URL: https://datasheet.octopart.com:443/ABM3-8.000MHZ-D2Y-T-Abracon-datasheet-12514944.pdf?src-supplier=Farnell; ComponentLink15Description: https://datasheet.octopart.com:443/ABM3-8.000MHZ-D2Y-T-Abracon-datasheet-12514944.pdf?src-supplier=Farnell; ComponentLink16URL: http://sigma.octopart.com:80/conflict_mineral_statement/Abracon-company-27.pdf?src-supplier=Compliance+Statements; ComponentLink16Description: http://sigma.octopart.com:80/conflict_mineral_statement/Abracon-company-27.pdf?src-supplier=Compliance+Statements